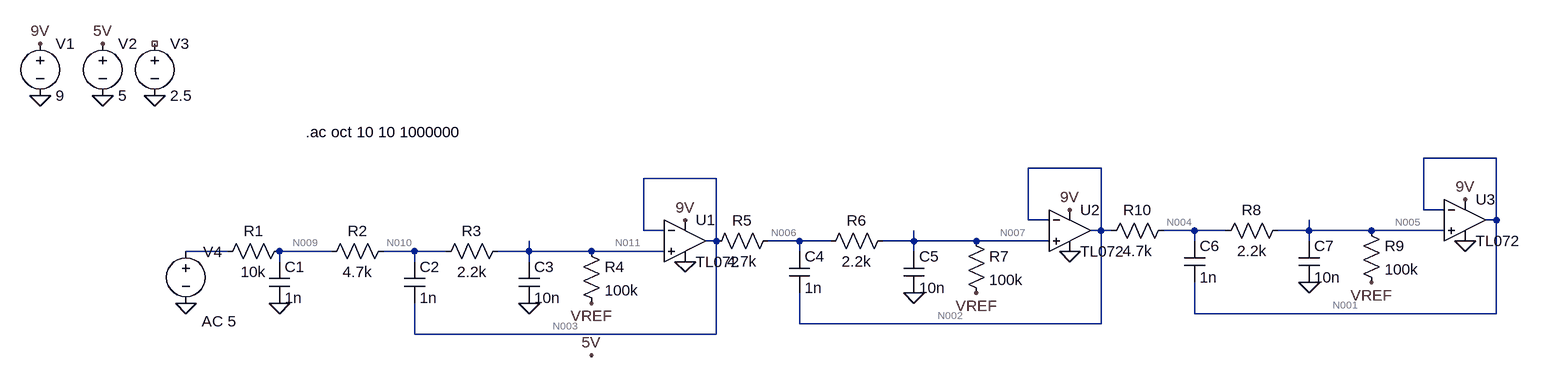
[diagram p0: schematic Draft2.asc]
* Draft2.asc
R1 N009 N008 10k
R2 N010 N009 4.7k
R3 N011 N010 2.2k
C1 N009 0 1n
C2 N010 N003 1n
C3 N011 0 10n
R4 N011 VREF 100k
V1 9V 0 9
V2 5V 0 5
V3 NC_01 0 2.5
* U1: TL072 (symbol TL072 not available, pins judged from their places): In+=N011 In-=N003 V+=9V V-=0 OUT=N003
V4 N008 0 AC 5
R5 N006 N003 4.7k
R6 N007 N006 2.2k
C4 N006 N002 1n
C5 N007 0 10n
R7 N007 VREF 100k
* U2: TL072 (symbol TL072 not available, pins judged from their places): In+=N007 In-=N002 V+=9V V-=0 OUT=N002
R8 N005 N004 2.2k
C6 N004 N001 1n
C7 N005 0 10n
R9 N005 VREF 100k
* U3: TL072 (symbol TL072 not available, pins judged from their places): In+=N005 In-=N001 V+=9V V-=0 OUT=N001
R10 N004 N002 4.7k
.ac oct 10 10 1000000
.backanno
.end

* Results of the author's LTspice run, read from the files saved beside the schematic
* Operating Point, zero values left out:
*   V(n009) = 260.5 mV
*   V(n010) = 382.9 mV
*   V(n011) = 440.2 mV
*   V(n003) = 1.532 V
*   V(vref) = 1.167 V
*   V(9v) = 9 V
*   V(5v) = 5 V
*   V(n006) = 1.516 V
*   V(n007) = 1.508 V
*   V(n002) = 1.579 V
*   V(n005) = 1.552 V
*   V(n004) = 1.561 V
*   V(n001) = 1.593 V
*   I(R1) = 26.05 µA
*   I(R2) = 26.05 µA
*   I(R3) = 26.05 µA
*   I(R4) = -7.267 µA
*   I(R5) = -3.415 µA
*   I(R6) = -3.415 µA
*   I(R7) = 3.415 µA
*   I(R8) = -3.852 µA
*   I(R9) = 3.852 µA
*   I(R10) = -3.852 µA
*   I(V1) = -13.18 mA
*   I(V4) = 26.05 µA
*   Ix(u1:1) = -18.78 µA
*   Ix(u1:2) = 32.19 pA
*   Ix(u1:3) = 4.395 mA
*   Ix(u1:4) = -4.248 mA
*   Ix(u1:5) = -3.415 µA
*   Ix(u2:1) = 31.48 pA
*   Ix(u2:2) = 31.7 pA
*   Ix(u2:3) = 4.395 mA
*   Ix(u2:4) = -4.376 mA
*   Ix(u2:5) = -3.852 µA
*   Ix(u3:1) = 31.55 pA
*   Ix(u3:2) = 31.68 pA
*   Ix(u3:3) = 4.395 mA
*   Ix(u3:4) = -4.385 mA
*   Ix(u3:5) = -31.68 pA
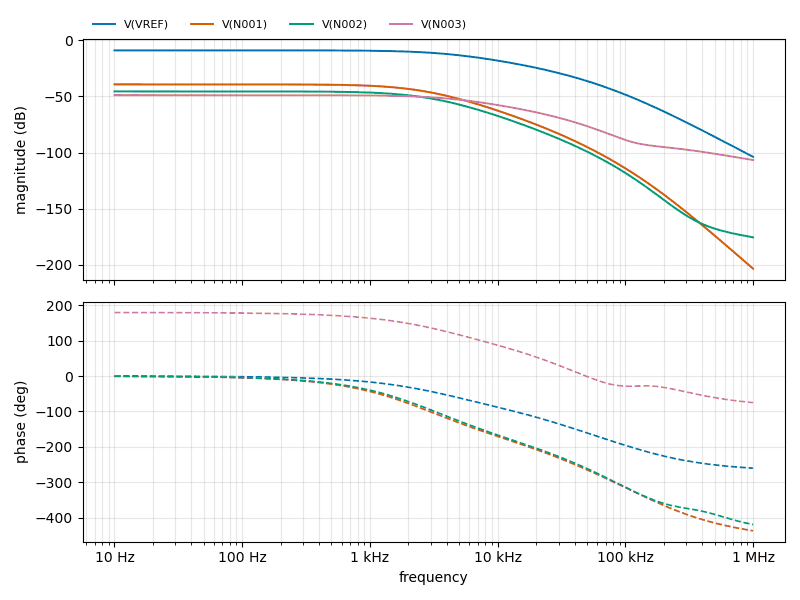
[diagram p1: AC Analysis of Draft2.asc, plotted from the saved traces]
* AC Analysis, 1 run:
*   V(VREF): -8.95 dB at 10 Hz, -103.82 dB at 1 MHz, peak -8.95 dB at 10 Hz, 3 dB below the peak at 3.764 kHz
*   V(N001): -39.27 dB at 10 Hz, -203.48 dB at 1 MHz, peak -39.27 dB at 10 Hz, 3 dB below the peak at 1.663 kHz
*   V(N002): -45.55 dB at 10 Hz, -175.59 dB at 1 MHz, peak -45.55 dB at 10 Hz, 3 dB below the peak at 1.835 kHz
*   V(N003): -48.89 dB at 10 Hz, -106.72 dB at 1 MHz, peak -48.89 dB at 10 Hz, 3 dB below the peak at 4.037 kHz